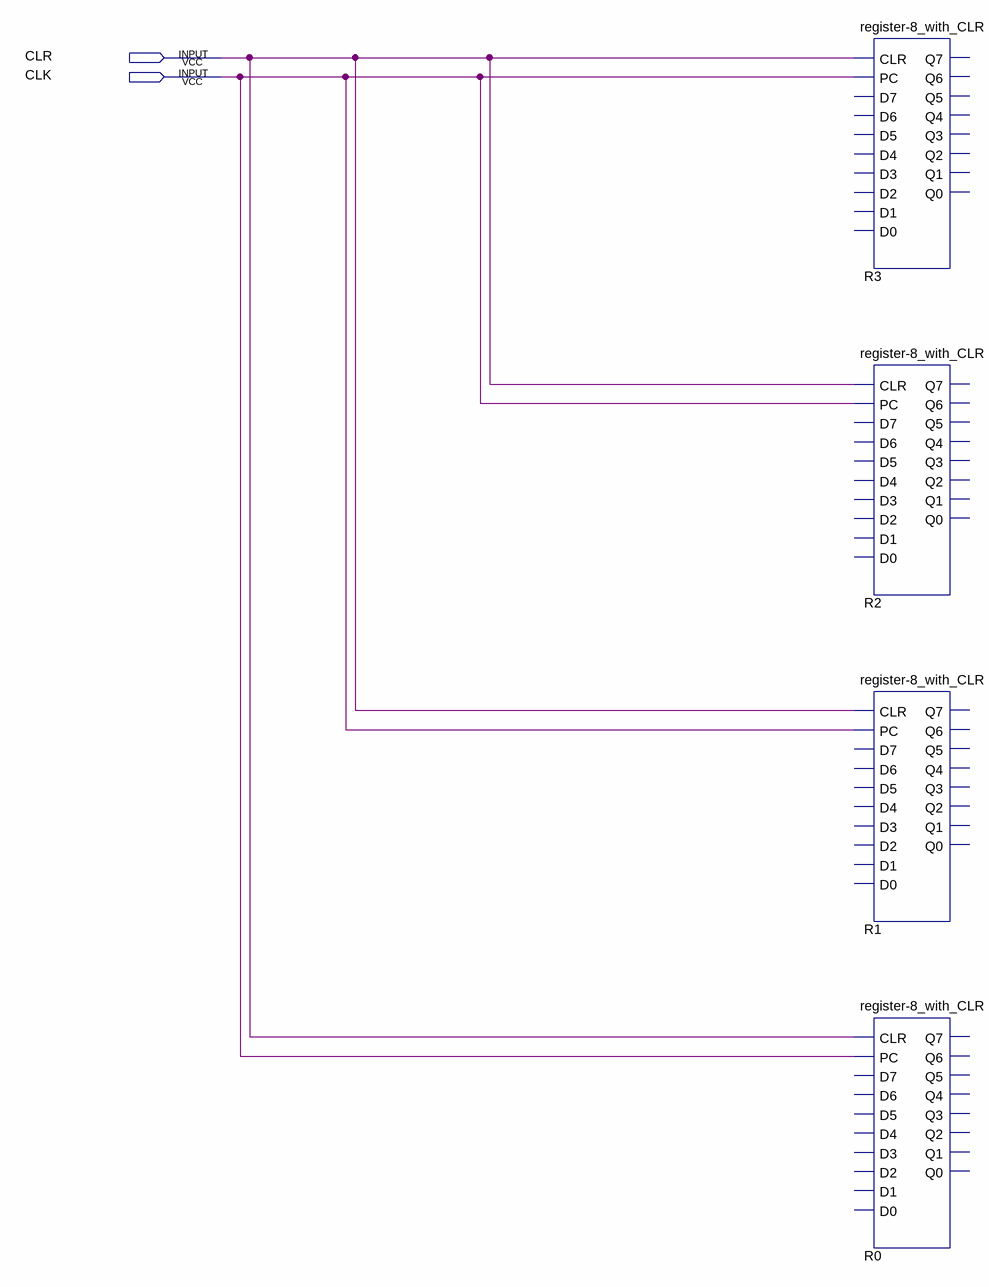
[diagram p0: schematic sheet]
// Quartus schematic register_4x.bdf as structural Verilog: 4 symbols, 2 pins
module register_4x (
  input  CLR,
  input  CLK
);

  \register-8_with_CLR  R3 (
    .CLR(CLR), .PC(CLK));  // open: D7, D6, D5, D4, D3, D2, D1, D0, Q7, Q6, Q5, Q4, Q3, Q2, Q1, Q0
  \register-8_with_CLR  R2 (
    .CLR(CLR), .PC(CLK));  // open: D7, D6, D5, D4, D3, D2, D1, D0, Q7, Q6, Q5, Q4, Q3, Q2, Q1, Q0
  \register-8_with_CLR  R1 (
    .CLR(CLR), .PC(CLK));  // open: D7, D6, D5, D4, D3, D2, D1, D0, Q7, Q6, Q5, Q4, Q3, Q2, Q1, Q0
  \register-8_with_CLR  R0 (
    .CLR(CLR), .PC(CLK));  // open: D7, D6, D5, D4, D3, D2, D1, D0, Q7, Q6, Q5, Q4, Q3, Q2, Q1, Q0
endmodule
